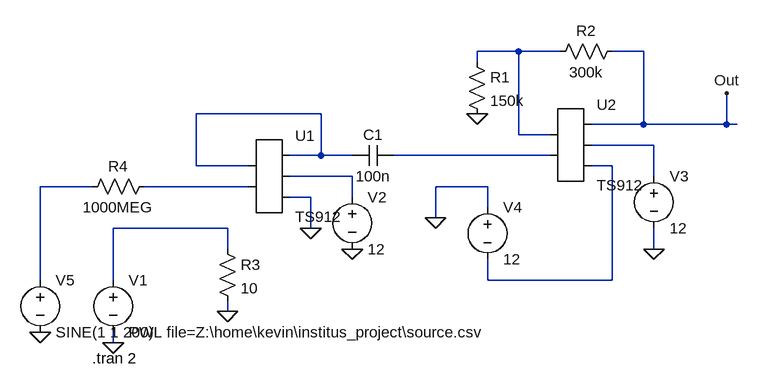
[diagram p0: schematic lcd01.asc]
lcd01.asc, the LTspice schematic file:
Version 4
SHEET 1 1016 680
WIRE 656 -208 592 -208
WIRE 720 -208 656 -208
WIRE 848 -208 800 -208
WIRE 592 -192 592 -208
WIRE 352 -112 160 -112
WIRE 848 -96 848 -208
WIRE 848 -96 768 -96
WIRE 976 -96 976 -144
WIRE 976 -96 848 -96
WIRE 992 -96 976 -96
WIRE 656 -80 656 -208
WIRE 704 -80 656 -80
WIRE 864 -64 768 -64
WIRE 352 -48 352 -112
WIRE 352 -48 304 -48
WIRE 400 -48 352 -48
WIRE 704 -48 464 -48
WIRE 160 -32 160 -112
WIRE 240 -32 160 -32
WIRE 800 -32 768 -32
WIRE 400 -16 304 -16
WIRE 864 -16 864 -64
WIRE 0 0 -80 0
WIRE 240 0 80 0
WIRE 608 0 528 0
WIRE 336 16 304 16
WIRE 400 16 400 -16
WIRE 608 32 608 0
WIRE 528 48 528 0
WIRE 208 64 32 64
WIRE 336 64 336 16
WIRE 208 96 208 64
WIRE 864 96 864 64
WIRE -80 144 -80 0
WIRE 32 144 32 64
WIRE 608 144 608 112
WIRE 800 144 800 -32
WIRE 800 144 608 144
WIRE 208 192 208 176
WIRE 32 240 32 224
FLAG 32 240 0
FLAG 336 64 0
FLAG 400 96 0
FLAG 976 -144 Out
FLAG 864 96 0
FLAG 592 -112 0
FLAG 528 48 0
FLAG -80 224 0
FLAG 208 192 0
SYMBOL voltage 32 128 R0
WINDOW 123 0 0 Left 2
WINDOW 39 0 0 Left 2
SYMATTR InstName V1
SYMATTR Value PWL file=Z:\home\kevin\institus_project\source.csv
SYMBOL AutoGenerated\\TS912 272 -16 R0
SYMATTR InstName U1
SYMBOL voltage 400 0 R0
WINDOW 123 0 0 Left 2
WINDOW 39 0 0 Left 2
SYMATTR InstName V2
SYMATTR Value 12
SYMBOL AutoGenerated\\TS912 736 -64 R0
SYMATTR InstName U2
SYMBOL cap 400 -32 R270
WINDOW 0 32 32 VTop 2
WINDOW 3 0 32 VBottom 2
SYMATTR InstName C1
SYMATTR Value 100n
SYMBOL voltage 864 -32 R0
WINDOW 123 0 0 Left 2
WINDOW 39 0 0 Left 2
SYMATTR InstName V3
SYMATTR Value 12
SYMBOL res 576 -208 R0
SYMATTR InstName R1
SYMATTR Value 150k
SYMBOL res 704 -192 R270
WINDOW 0 32 56 VTop 2
WINDOW 3 0 56 VBottom 2
SYMATTR InstName R2
SYMATTR Value 300k
SYMBOL voltage 608 16 R0
WINDOW 123 0 0 Left 2
WINDOW 39 0 0 Left 2
SYMATTR InstName V4
SYMATTR Value 12
SYMBOL voltage -80 128 R0
WINDOW 123 0 0 Left 2
WINDOW 39 0 0 Left 2
SYMATTR InstName V5
SYMATTR Value SINE(1 1 200)
SYMBOL res 192 80 R0
SYMATTR InstName R3
SYMATTR Value 10
SYMBOL res -16 16 R270
WINDOW 0 32 56 VTop 2
WINDOW 3 0 56 VBottom 2
SYMATTR InstName R4
SYMATTR Value 1000MEG
TEXT 0 264 Left 2 !.tran 2

The netlist it stands for:
* lcd01.asc
V1 N009 0 PWL file=Z:\home\kevin\institus_project\source.csv
* U1: TS912 (symbol AutoGenerated\TS912 not available, pins judged from their places): pin1=N002 pin2=N008 pin3=N002 pin4=N006 pin5=0
V2 N006 0 12
* U2: TS912 (symbol AutoGenerated\TS912 not available, pins judged from their places): pin1=N001 pin2=N004 pin3=Out pin4=N003 pin5=N005
C1 N002 N004 100n
V3 N003 0 12
R1 N001 0 150k
R2 N001 Out 300k
V4 0 N005 12
V5 N007 0 SINE(1 1 200)
R3 N009 0 10
R4 N007 N008 1000MEG
.tran 2
.backanno
.end